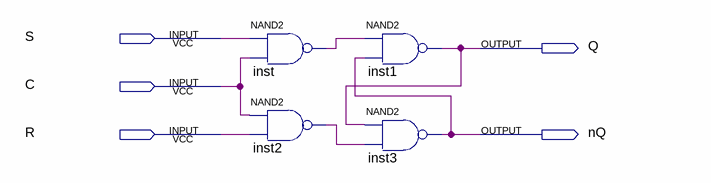
[diagram p0: schematic sheet]
// Quartus schematic t3.bdf as structural Verilog: 4 symbols, 5 pins
module t3 (
  input  S,
  input  C,
  input  R,
  output Q,
  output nQ
);

  wire inst2_out, inst_out;

  nand inst (inst_out, S, C);
  nand inst2 (inst2_out, C, R);
  nand inst1 (Q, inst_out, nQ);
  nand inst3 (nQ, Q, inst2_out);
endmodule
